# Altium project Sampling_Scope.PrjPcb (part 2 of 4)

## Sheet MCU.SchDoc
size A3; ApprovedBy: Mateusz Kowalik; CheckedBy: Mateusz Kowalik; Author: Mateusz Kowalik; CompanyName: InMotion Labs sp. z o.o.; DrawnBy: Mateusz Kowalik; Engineer: Mateusz Kowalik; Organization: InMotion Labs sp. z o.o.; Address1: Rydlówka 5A; Address2: 30-363 Kraków; Address4: Poland; DocumentNumber: 4; Revision: Rev 0; SheetNumber: 3; SheetTotal: 17
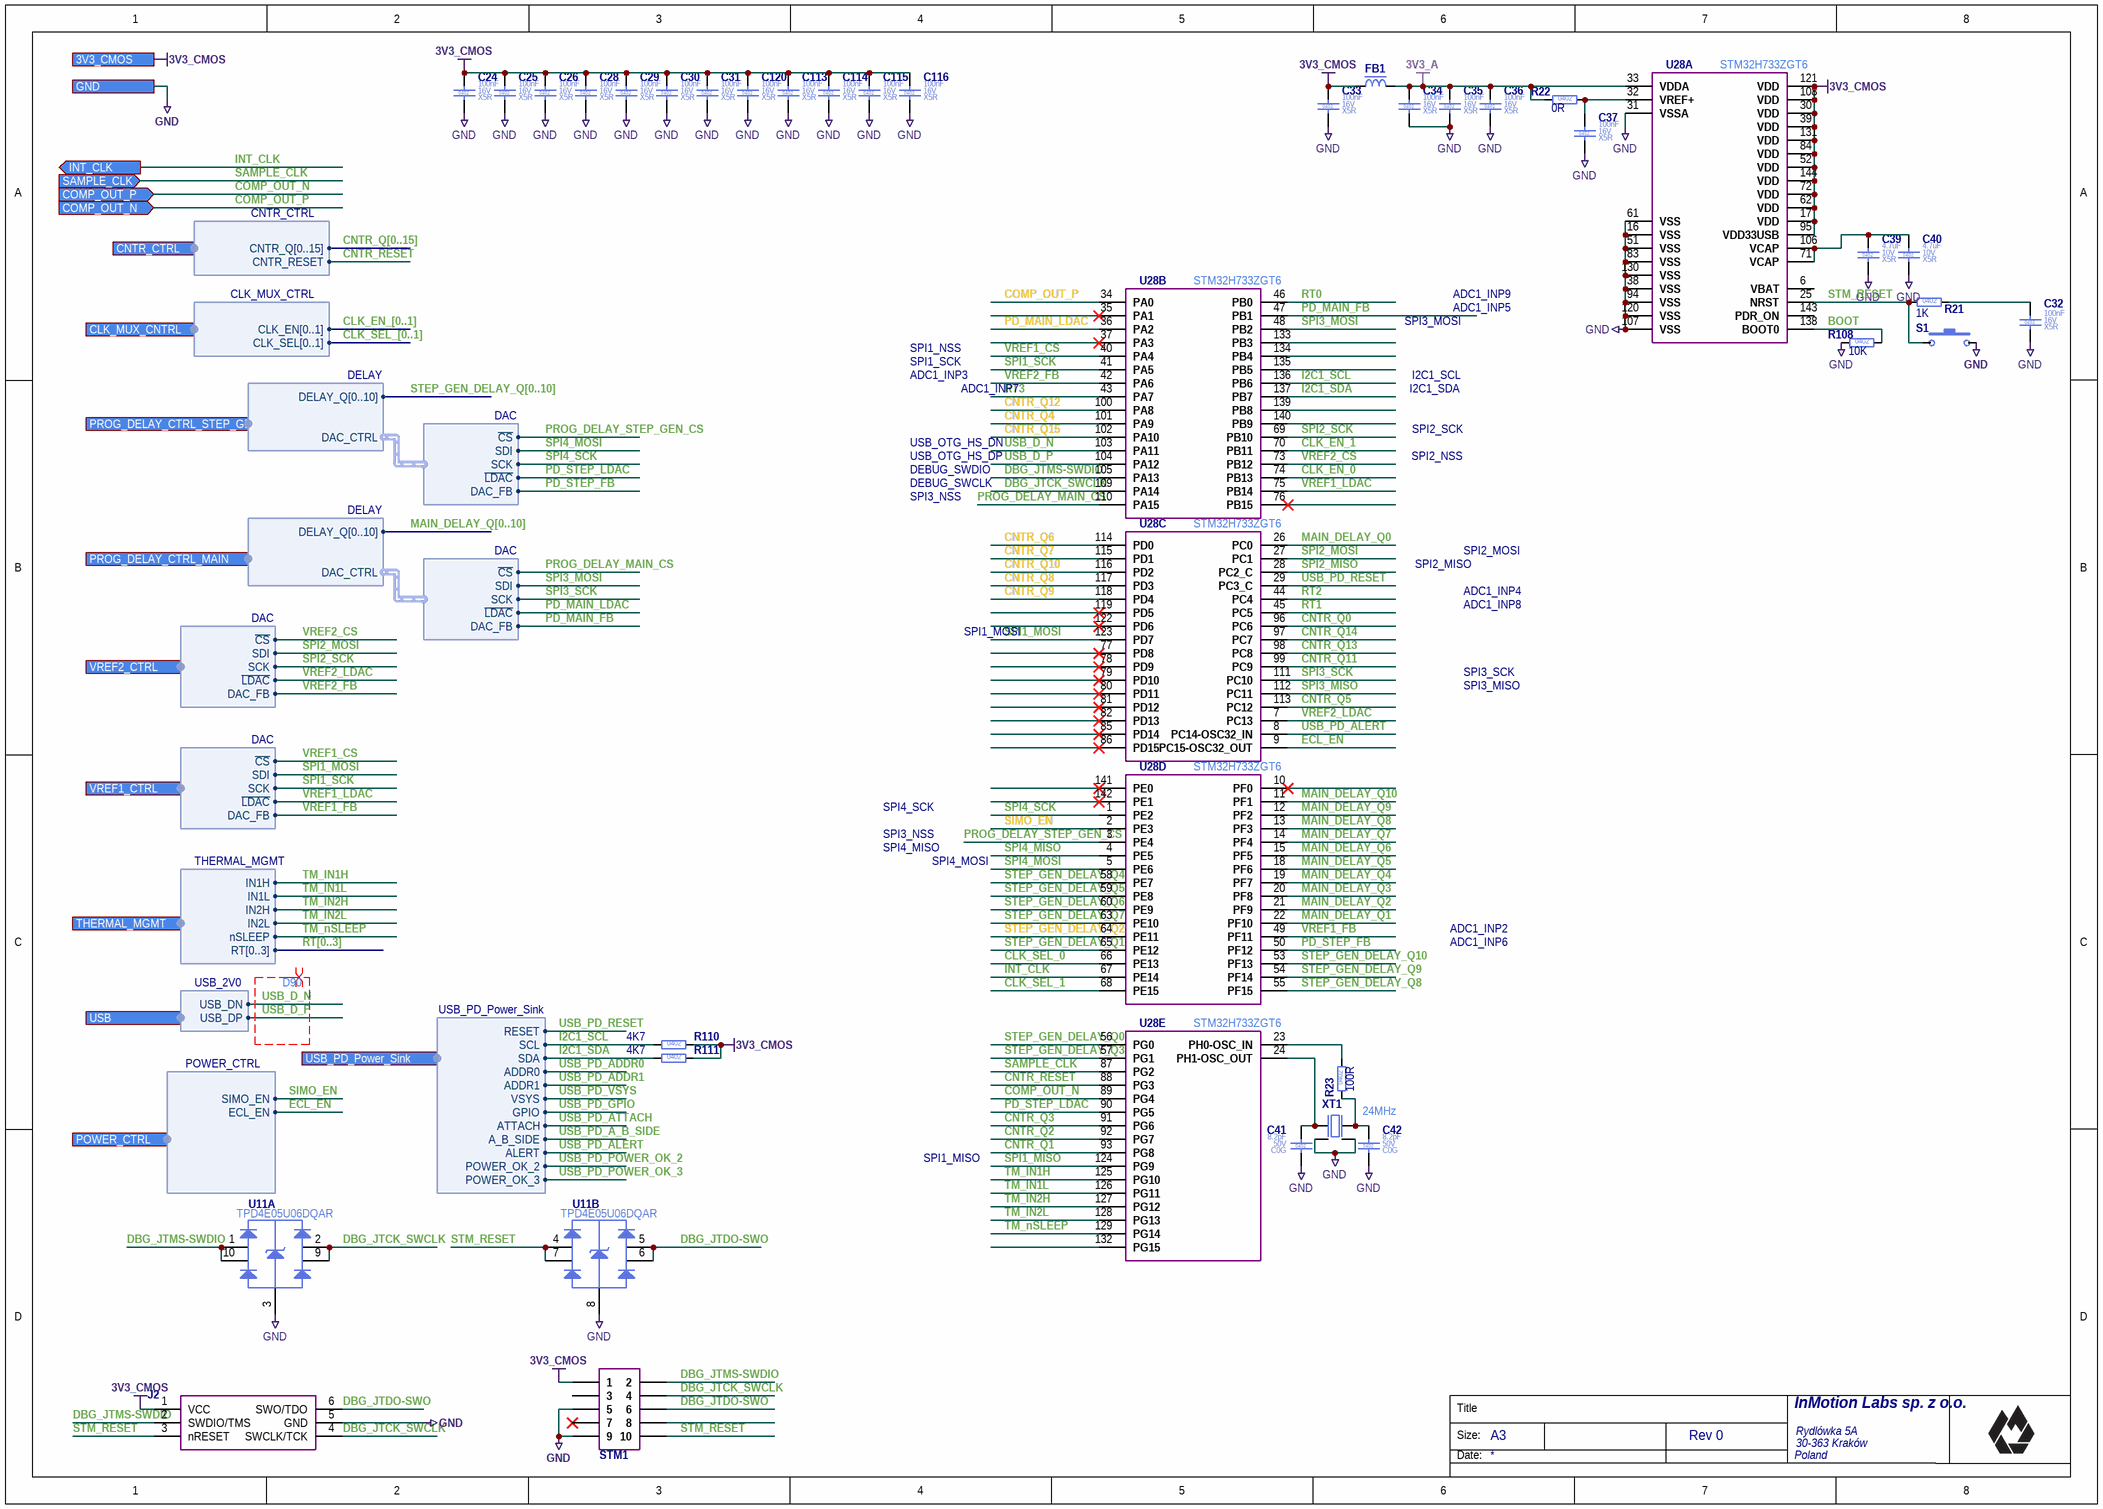
[diagram p5: MCU.SchDoc]

### Parts
C24  Case/Package: 0402  Voltage Rating (DC): 16V  Dielectric: X5R  Capacitance: 100nF  [C_0402_1005]  (hidden comment: C_100NF_16V_X5R_0402_10)
C25  Case/Package: 0402  Voltage Rating (DC): 16V  Dielectric: X5R  Capacitance: 100nF  [C_0402_1005]  (hidden comment: C_100NF_16V_X5R_0402_10)
C26  Case/Package: 0402  Voltage Rating (DC): 16V  Dielectric: X5R  Capacitance: 100nF  [C_0402_1005]  (hidden comment: C_100NF_16V_X5R_0402_10)
C28  Case/Package: 0402  Voltage Rating (DC): 16V  Dielectric: X5R  Capacitance: 100nF  [C_0402_1005]  (hidden comment: C_100NF_16V_X5R_0402_10)
C29  Case/Package: 0402  Voltage Rating (DC): 16V  Dielectric: X5R  Capacitance: 100nF  [C_0402_1005]  (hidden comment: C_100NF_16V_X5R_0402_10)
C30  Case/Package: 0402  Voltage Rating (DC): 16V  Dielectric: X5R  Capacitance: 100nF  [C_0402_1005]  (hidden comment: C_100NF_16V_X5R_0402_10)
C31  Case/Package: 0402  Voltage Rating (DC): 16V  Dielectric: X5R  Capacitance: 100nF  [C_0402_1005]  (hidden comment: C_100NF_16V_X5R_0402_10)
C32  Case/Package: 0402  Voltage Rating (DC): 16V  Dielectric: X5R  Capacitance: 100nF  [C_0402_1005]  (hidden comment: C_100NF_16V_X5R_0402_10)
C33  Case/Package: 0402  Voltage Rating (DC): 16V  Dielectric: X5R  Capacitance: 100nF  [C_0402_1005]  (hidden comment: C_100NF_16V_X5R_0402_10)
C34  Case/Package: 0402  Voltage Rating (DC): 16V  Dielectric: X5R  Capacitance: 100nF  [C_0402_1005]  (hidden comment: C_100NF_16V_X5R_0402_10)
C35  Case/Package: 0402  Voltage Rating (DC): 16V  Dielectric: X5R  Capacitance: 100nF  [C_0402_1005]  (hidden comment: C_100NF_16V_X5R_0402_10)
C36  Case/Package: 0402  Voltage Rating (DC): 16V  Dielectric: X5R  Capacitance: 100nF  [C_0402_1005]  (hidden comment: C_100NF_16V_X5R_0402_10)
C37  Case/Package: 0402  Voltage Rating (DC): 16V  Dielectric: X5R  Capacitance: 100nF  [C_0402_1005]  (hidden comment: C_100NF_16V_X5R_0402_10)
C39  Case/Package: 0402  Voltage Rating (DC): 10V  Dielectric: X5R  Capacitance: 4.7uF  [C_0402_1005]  (hidden comment: C_4U7F_10V_X5R_0402_20)
C40  Case/Package: 0402  Voltage Rating (DC): 10V  Dielectric: X5R  Capacitance: 4.7uF  [C_0402_1005]  (hidden comment: C_4U7F_10V_X5R_0402_20)
C41  Case/Package: 0402  Voltage Rating (DC): 50V  Dielectric: C0G  Capacitance: 8.2pF  [C_0402_1005]  (hidden comment: C_8P2F_50V_C0G_0402_3)
C42  Case/Package: 0402  Voltage Rating (DC): 50V  Dielectric: C0G  Capacitance: 8.2pF  [C_0402_1005]  (hidden comment: C_8P2F_50V_C0G_0402_3)
C113  Case/Package: 0402  Voltage Rating (DC): 16V  Dielectric: X5R  Capacitance: 100nF  [C_0402_1005]  (hidden comment: C_100NF_16V_X5R_0402_10)
C114  Case/Package: 0402  Voltage Rating (DC): 16V  Dielectric: X5R  Capacitance: 100nF  [C_0402_1005]  (hidden comment: C_100NF_16V_X5R_0402_10)
C115  Case/Package: 0402  Voltage Rating (DC): 16V  Dielectric: X5R  Capacitance: 100nF  [C_0402_1005]  (hidden comment: C_100NF_16V_X5R_0402_10)
C116  Case/Package: 0402  Voltage Rating (DC): 16V  Dielectric: X5R  Capacitance: 100nF  [C_0402_1005]  (hidden comment: C_100NF_16V_X5R_0402_10)
C120  Case/Package: 0402  Voltage Rating (DC): 16V  Dielectric: X5R  Capacitance: 100nF  [C_0402_1005]  (hidden comment: C_100NF_16V_X5R_0402_10)
FB1  MLZ2012M2R2HT000  [FB_0805_2012]  (value not drawn)
J2  TC2030-IDC-NL  [TC2030-IDC-NL]  (value not drawn)  (no BOM)
R21  Resistance: 1K  Case/Package: 0402  [R_0402_1005]  (hidden comment: R_1K_0402_1)
R22  Resistance: 0R  Case/Package: 0402  [R_0402_1005]  (hidden comment: R_0R_0402_1)
R23  Resistance: 100R  Case/Package: 0402  [R_0402_1005]  (hidden comment: R_100R_0402_1)
R108  Resistance: 10K  Case/Package: 0402  [R_0402_1005]  (hidden comment: R_10K_0402_1)
R110  Resistance: 4K7  Case/Package: 0402  [R_0402_1005]  (hidden comment: R_4K7_0402_1)
R111  Resistance: 4K7  Case/Package: 0402  [R_0402_1005]  (hidden comment: R_4K7_0402_1)
S1  EVQ-P7J01P  [EVQ-P7J01P]  (value not drawn)
STM1  FTSH-105-01-L-DV-K-TR  [FTSH-105-01-L-DV-K-TR]  (value not drawn)
U11  TPD4E05U06DQAR  [SON50P100X55-10N]  (parts A,B of 2)
U28  STM32H733ZGT6  [TSQFP50P2200X2200X160-144N]  (parts A,B,C,D,E of 5)
XT1  Frequency: 24MHz  [X_3.2x2.5]  (hidden comment: TSX-3225 24.0000MF20G-AC)

### Ports
3V3_CMOS, CLK_MUX_CNTRL (harness CLK_MUX_CTRL), CNTR_CTRL (harness CNTR_CTRL), COMP_OUT_N (in), COMP_OUT_P (in), GND, INT_CLK (out), POWER_CTRL (harness POWER_CTRL), PROG_DELAY_CTRL_MAIN (harness DELAY), PROG_DELAY_CTRL_STEP_GEN (harness DELAY), SAMPLE_CLK (in), THERMAL_MGMT (harness THERMAL_MGMT), USB (harness USB_2V0), USB_PD_Power_Sink (harness USB_PD_Power_Sink), VREF1_CTRL (harness DAC), VREF2_CTRL (harness DAC)

### Harnesses
DELAY: DELAY_Q[0..10], DAC_CTRL
CNTR_CTRL: CNTR_Q[0..15], CNTR_RESET
CLK_MUX_CTRL: CLK_SEL[0..1], CLK_EN[0..1]
DAC: ~{CS}, SDI, SCK, ~{LDAC}, DAC_FB
THERMAL_MGMT: IN1H, IN1L, IN2H, IN2L, nSLEEP, RT[0..3]
USB_2V0: USB_DN, USB_DP
USB_PD_Power_Sink: RESET, SCL, SDA, ADDR0, ADDR1, VSYS, GPIO, ATTACH, A_B_SIDE, ALERT, POWER_OK_2, POWER_OK_3
POWER_CTRL: SIMO_EN, ECL_EN

### Nets
3V3_A: C34.1 C35.1 C36.1 FB1.2 R22.1 U28.33(VDDA)
3V3_CMOS: C24.1 C25.1 C26.1 C28.1 C29.1 C30.1 C31.1 C33.1 C113.1 C114.1 C115.1 C116.1 C120.1 FB1.1 J2.1(VCC) R110.2 R111.2 STM1.1 U28.17(VDD) U28.30(VDD) U28.39(VDD) U28.52(VDD) U28.62(VDD) U28.72(VDD) U28.84(VDD) U28.95(VDD33USB) U28.108(VDD) U28.121(VDD) U28.131(VDD) U28.144(VDD) ; port 3V3_CMOS
GND: C24.2 C25.2 C26.2 C28.2 C29.2 C30.2 C31.2 C32.2 C33.2 C34.2 C35.2 C36.2 C37.2 C39.2 C40.2 C41.2 C42.2 C113.2 C114.2 C115.2 C116.2 C120.2 J2.5(GND) R108.1 S1.2 STM1.5 STM1.9 U11.3(GND) U11.8(GND) U28.16(VSS) U28.31(VSSA) U28.38(VSS) U28.51(VSS) U28.61(VSS) U28.83(VSS) U28.94(VSS) U28.107(VSS) U28.120(VSS) U28.130(VSS) XT1.2(GND) XT1.4(GND) ; port GND
BOOT: R108.2 U28.138(BOOT0)  [project net BOOT_3]
CLK_EN_0: U28.74(PB13)
CLK_EN_1: U28.70(PB11)
CLK_SEL_0: U28.66(PE13)
CLK_SEL_1: U28.68(PE15)
CNTR_Q0: U28.96(PC6)
CNTR_Q1: U28.93(PG8)
CNTR_Q2: U28.92(PG7)
CNTR_Q3: U28.91(PG6)
CNTR_Q4: U28.101(PA9)
CNTR_Q5: U28.113(PC12)
CNTR_Q6: U28.114(PD0)
CNTR_Q7: U28.115(PD1)
CNTR_Q8: U28.117(PD3)
CNTR_Q9: U28.118(PD4)
CNTR_Q10: U28.116(PD2)
CNTR_Q11: U28.99(PC9)
CNTR_Q12: U28.100(PA8)
CNTR_Q13: U28.98(PC8)
CNTR_Q14: U28.97(PC7)
CNTR_Q15: U28.102(PA10)
CNTR_RESET: U28.88(PG3) ; port CNTR_CTRL.CNTR_RESET  [project net CNTR_CTRL.CNTR_RESET]
COMP_OUT_N: U28.89(PG4) ; port COMP_OUT_P
COMP_OUT_P: U28.34(PA0) ; port COMP_OUT_N
DBG_JTCK_SWCLK: J2.4(SWCLK/TCK) STM1.4 U11.2(D1-) U11.9(NC) U28.109(PA14)  [project net DBG_JTCK_SWCLK_3]
DBG_JTDO-SWO: J2.6(SWO/TDO) STM1.6 U11.5(D2-) U11.6(NC)  [project net DBG_JTDO-SWO_3]
DBG_JTMS-SWDIO: J2.2(SWDIO/TMS) STM1.2 U11.1(D1+) U11.10(NC) U28.105(PA13)  [project net DBG_JTMS-SWDIO_3]
ECL_EN: U28.9(PC15-OSC32_OUT) ; port POWER_CTRL.ECL_EN  [project net POWER_CTRL.ECL_EN]
I2C1_SCL: R110.1 U28.136(PB6) ; port USB_PD_Power_Sink.SCL  [project net USB_PD_Power_Sink.SCL]
I2C1_SDA: R111.1 U28.137(PB7) ; port USB_PD_Power_Sink.SDA  [project net USB_PD_Power_Sink.SDA]
INT_CLK: U28.67(PE14) ; port INT_CLK
MAIN_DELAY_Q0: U28.26(PC0)  [project net DELAY_Q0]
MAIN_DELAY_Q1: U28.22(PF10)  [project net DELAY_Q1]
MAIN_DELAY_Q2: U28.21(PF9)  [project net DELAY_Q2]
MAIN_DELAY_Q3: U28.20(PF8)  [project net DELAY_Q3]
MAIN_DELAY_Q4: U28.19(PF7)  [project net DELAY_Q4]
MAIN_DELAY_Q5: U28.18(PF6)  [project net DELAY_Q5]
MAIN_DELAY_Q6: U28.15(PF5)  [project net DELAY_Q6]
MAIN_DELAY_Q7: U28.14(PF4)  [project net DELAY_Q7]
MAIN_DELAY_Q8: U28.13(PF3)  [project net DELAY_Q8]
MAIN_DELAY_Q9: U28.12(PF2)  [project net DELAY_Q9]
MAIN_DELAY_Q10: U28.11(PF1)  [project net DELAY_Q10]
PD_MAIN_FB: U28.47(PB1) ; harness DAC.DAC_FB
PD_MAIN_LDAC: U28.36(PA2) ; harness DAC.~{LDAC}
PD_STEP_FB: U28.50(PF12) ; harness DAC.DAC_FB
PD_STEP_LDAC: U28.90(PG5) ; harness DAC.~{LDAC}
PROG_DELAY_MAIN_CS: U28.110(PA15) ; harness DAC.~{CS}
PROG_DELAY_STEP_GEN_CS: U28.3(PE4) ; harness DAC.~{CS}
RT0: U28.46(PB0)
RT1: U28.45(PC5)
RT2: U28.44(PC4)
RT3: U28.43(PA7)
SAMPLE_CLK: U28.87(PG2) ; port SAMPLE_CLK
SIMO_EN: U28.2(PE3) ; port POWER_CTRL.SIMO_EN  [project net POWER_CTRL.SIMO_EN]
SPI1_MISO: U28.124(PG9)  [project net SPI1_MISO_3]
SPI1_MOSI: U28.123(PD7) ; port VREF1_CTRL.SDI  [project net VREF_P_CTRL.SDI]
SPI1_SCK: U28.41(PA5) ; port VREF1_CTRL.SCK  [project net VREF_P_CTRL.SCK]
SPI2_MISO: U28.28(PC2_C)  [project net SPI2_MISO_3]
SPI2_MOSI: U28.27(PC1) ; port VREF2_CTRL.SDI  [project net VREF_N_CTRL.SDI]
SPI2_SCK: U28.69(PB10) ; port VREF2_CTRL.SCK  [project net VREF_N_CTRL.SCK]
SPI3_MISO: U28.112(PC11)  [project net SPI3_MISO_3]
SPI3_MOSI: U28.48(PB2) ; harness DAC.SDI
SPI3_SCK: U28.111(PC10) ; harness DAC.SCK
SPI4_MISO: U28.4(PE5)  [project net SPI4_MISO_3]
SPI4_MOSI: U28.5(PE6) ; harness DAC.SDI
SPI4_SCK: U28.1(PE2) ; harness DAC.SCK
STEP_GEN_DELAY_Q0: U28.56(PG0)  [project net DELAY_Q0]
STEP_GEN_DELAY_Q1: U28.65(PE12)  [project net DELAY_Q1]
STEP_GEN_DELAY_Q2: U28.64(PE11)  [project net DELAY_Q2]
STEP_GEN_DELAY_Q3: U28.57(PG1)  [project net DELAY_Q3]
STEP_GEN_DELAY_Q4: U28.58(PE7)  [project net DELAY_Q4]
STEP_GEN_DELAY_Q5: U28.59(PE8)  [project net DELAY_Q5]
STEP_GEN_DELAY_Q6: U28.60(PE9)  [project net DELAY_Q6]
STEP_GEN_DELAY_Q7: U28.63(PE10)  [project net DELAY_Q7]
STEP_GEN_DELAY_Q8: U28.55(PF15)  [project net DELAY_Q8]
STEP_GEN_DELAY_Q9: U28.54(PF14)  [project net DELAY_Q9]
STEP_GEN_DELAY_Q10: U28.53(PF13)  [project net DELAY_Q10]
STM_RESET: J2.3(nRESET) R21.1 S1.1 STM1.10 U11.4(D2+) U11.7(NC) U28.25(NRST)  [project net STM_RESET_3]
TM_IN1H: U28.125(PG10) ; port THERMAL_MGMT.IN1H  [project net THERMAL_MGMT.IN1H]
TM_IN1L: U28.126(PG11) ; port THERMAL_MGMT.IN1L  [project net THERMAL_MGMT.IN1L]
TM_IN2H: U28.127(PG12) ; port THERMAL_MGMT.IN2H  [project net THERMAL_MGMT.IN2H]
TM_IN2L: U28.128(PG13) ; port THERMAL_MGMT.IN2L  [project net THERMAL_MGMT.IN2L]
TM_nSLEEP: U28.129(PG14) ; port THERMAL_MGMT.nSLEEP  [project net THERMAL_MGMT.nSLEEP]
USB_D_N: U28.103(PA11) ; port USB.USB_DN
USB_D_P: U28.104(PA12) ; port USB.USB_DP
USB_PD_ALERT: U28.8(PC14-OSC32_IN) ; port USB_PD_Power_Sink.ALERT  [project net USB_PD_Power_Sink.ALERT]
USB_PD_RESET: U28.29(PC3_C) ; port USB_PD_Power_Sink.RESET  [project net USB_PD_Power_Sink.RESET]
VREF1_CS: U28.40(PA4) ; port VREF1_CTRL.~{CS}  [project net VREF_P_CTRL~{.}CS]
VREF1_FB: U28.49(PF11) ; port VREF1_CTRL.DAC_FB  [project net VREF_P_CTRL.DAC_FB]
VREF1_LDAC: U28.75(PB14) ; port VREF1_CTRL.~{LDAC}  [project net VREF_P_CTRL~{.}LDAC]
VREF2_CS: U28.73(PB12) ; port VREF2_CTRL.~{CS}  [project net VREF_N_CTRL~{.}CS]
VREF2_FB: U28.42(PA6) ; port VREF2_CTRL.DAC_FB  [project net VREF_N_CTRL.DAC_FB]
VREF2_LDAC: U28.7(PC13) ; port VREF2_CTRL.~{LDAC}  [project net VREF_N_CTRL~{.}LDAC]
NetC32_1: C32.1 R21.2
NetC37_1: C37.1 R22.2 U28.32(VREF+)
NetC39_1: C39.1 C40.1 U28.71(VCAP) U28.106(VCAP)
NetC41_1: C41.1 U28.24(PH1-OSC_OUT) XT1.1(IN)
NetC42_1: C42.1 R23.1 XT1.3(OUT)
NetR23_2: R23.2 U28.23(PH0-OSC_IN)

Not connected (* = marked no-connect by the designer): STM1 3 7* 8; U28 6(VBAT) 10(PF0)* 35(PA1)* 37(PA3)* 76(PB15)* 77(PD8)* 78(PD9)* 79(PD10)* 80(PD11)* 81(PD12)* 82(PD13)* 85(PD14)* 86(PD15)* 119(PD5)* 122(PD6)* 132(PG15) 133(PB3) 134(PB4) 135(PB5) 139(PB8) 140(PB9) 141(PE0)* 142(PE1)* 143(PDR_ON)

### Buses and harness runs
bus CLK_EN_[0..1]
bus CLK_SEL_[0..1]
bus CNTR_Q[0..15]
bus MAIN_DELAY_Q[0..10]
bus RT[0..3]
bus STEP_GEN_DELAY_Q[0..10]

### Layout directives
differential pair; differential pair class D90: USB_D_N, USB_D_P

### Notes on the sheet
- ADC1_INP5
- ADC1_INP9
- ADC1_INP3
- SPI1_SCK
- SPI1_NSS
- SPI3_MOSI
- I2C1_SCL
- USB_OTG_HS_DN
- ADC1_INP7
- I2C1_SDA
- SPI2_SCK
- USB_OTG_HS_DP
- DEBUG_SWCLK
- DEBUG_SWDIO
- SPI3_NSS
- SPI2_NSS
- SPI2_MISO
- SPI2_MOSI
- SPI1_MOSI
- ADC1_INP4
- ADC1_INP8
- SPI3_SCK
- SPI3_MISO
- SPI4_MISO
- SPI4_SCK
- SPI4_MOSI
- ADC1_INP6
- ADC1_INP2
- SPI1_MISO
- Title
- Size:
- Date:
- A3

### Library data of the parts
C24-C26 C28-C31 C33-C37 C113-C116 C120 = C_100NF_16V_X5R_0402_10: as C1 on sheet Main; Part Number: C_100NF_16V_X5R_0402_10; Mount: Surface Mount; Height: 500um; HelpURL: http://datasheet.octopart.com/EMK105BJ104KV-F-Taiyo-Yuden-datasheet-8857305.pdf; RoHS: Compliant; Max Operating Temperature: 125°C; Status: MK; Supplier 1: Mouser; Supplier Part Number 1: 963-EMK105BJ104KV-F; Manufacturer 2: Samsung Electro-Mechanics; Manufacturer Part Number 2: CL05B104KO5NNNC; Supplier 2: LCSC; Supplier Part Number 2: C1525
C32 = C_100NF_16V_X5R_0402_10: Ceramic Capacitor; Manufacturer Part Number: EMK105BJ104KV-F; Manufacturer: Taiyo Yuden; Tolerance: 10%; Value: 100nF; Part Number: C_100NF_16V_X5R_0402_10; Mount: Surface Mount; Height: 500um; HelpURL: http://datasheet.octopart.com/EMK105BJ104KV-F-Taiyo-Yuden-datasheet-8857305.pdf; RoHS: Compliant; Max Operating Temperature: 125°C; Status: MK; Supplier 1: Mouser; Supplier Part Number 1: 963-EMK105BJ104KV-F; Manufacturer 2: Samsung Electro-Mechanics; Manufacturer Part Number 2: CL05B104KO5NNNC; Supplier 2: LCSC; Supplier Part Number 2: C1525
C39 C40 = C_4U7F_10V_X5R_0402_20: Ceramic Capacitor; Manufacturer Part Number: CL05A475MP5NRNC; Manufacturer: Samsung Electro-Mechanics; Value: 4.7uF; Tolerance: 20%; Part Number: C_4U7F_10V_X5R_0402_20; Mount: Surface Mount; Height: 550um; HelpURL: https://pl.mouser.com/datasheet/2/585/MLCC-1837944.pdf; RoHS: Compliant; Max Operating Temperature: 85°C; Status: MK; Supplier 1: Mouser; Supplier Part Number 1: 187-CL05A475MP5NRNC; Manufacturer 2: Samsung Electro-Mechanics; Manufacturer Part Number 2: CL05A475MP5NRNC; Supplier 2: LCSC; Supplier Part Number 2: C23733
C41 C42 = C_8P2F_50V_C0G_0402_3: Ceramic Capacitor; Manufacturer Part Number: UMK105CG8R2DV-F; Manufacturer: Taiyo Yuden; Value: 8.2pF; Tolerance: 3%; Part Number: C_8P2F_50V_C0G_0402_3; Mount: Surface Mount; Height: 500um; HelpURL: https://pl.mouser.com/datasheet/2/396/mlcc02_e-1307760.pdf; RoHS: Compliant; Max Operating Temperature: 125°C; Status: MK; Supplier 1: Mouser; Supplier Part Number 1: 963-UMK105CG8R2DV-F
FB1 = MLZ2012M2R2HT000: Ferrite Bead; Manufacturer: TDK; Max Current Rating: 600mA; Frequency: 2MHz; Impedance: 30; Tolerance: 20; DC Resistance (DCR): 208m; Box: 412; Part Number: MLZ2012M2R2HT000; Case/Package: 0805; Manufacturer Part Number: MLZ2012M2R2HT000; Height: 1.45mm; Mount: Surface Mount; Max Operating Temperature: 125°C; HelpURL: https://product.tdk.com/info/en/catalog/datasheets/inductor_commercial_decoupling_mlz2012_en.pdf?ref_disty=mouser; RoHS: Compliant; Status: MK; Supplier 1: Mouser; Supplier Part Number 1: 810-MLZ2012M2R2HT000; Stock: 15
J2 = TC2030-IDC-NL: Pads to program board through TC2030; Manufacturer: Tag-Connect; Part Number: TC2030-IDC-NL; Manufacturer Part Number: TC2030-IDC-NL; Number of Rows: 2
R21 = R_1K_0402_1: Thick Film Resistor; Manufacturer: Yageo; Manufacturer Part Number: RC0402FR-7D1KL; Tolerance: 1%; Voltage Rating (DC): 50V; Power Rating: 63mW; Stats: MK; Value: 1K; Part Number: R_1K_0402_1; Mount: Surface Mount; Height: 350um; HelpURL: https://pl.mouser.com/datasheet/2/447/PYu-RC_Group_51_RoHS_L_10-1664068.pdf; RoHS: Compliant; Max Operating Temperature: 155°C; Supplier 1: Mouser; Supplier Part Number 1: 603-RC0402FR-7D1KL; Manufacturer 2: Uniroyal Elec; Manufacturer Part Number 2: 0402WGF1001TCE; Supplier 2: LCSC; Supplier Part Number 2: C11702
R22 = R_0R_0402_1: as R11 on sheet Comparator-Sampler; Part Number: R_0R_0402_1; Mount: Surface Mount; Height: 350um; HelpURL: http://datasheet.octopart.com/2176049-1-TE-Connectivity---AMP-datasheet-11120217.pdf; RoHS: Compliant; Max Operating Temperature: 155°C; Supplier 1: Mouser; Supplier Part Number 1: 603-RC0402FR-070RL; Manufacturer 2: Uniroyal Elec; Manufacturer Part Number 2: 0402WGF0000TCE; Supplier 2: LCSC; Supplier Part Number 2: C17168
R23 = R_100R_0402_1: Thick Film Resistor; Manufacturer: Yageo; Manufacturer Part Number: RC0402FR-13100RL; Value: 100R; Tolerance: 1%; Voltage Rating (DC): 50V; Power Rating: 63mW; Part Number: R_100R_0402_1; Mount: Surface Mount; Height: 350um; HelpURL: https://pl.mouser.com/datasheet/2/447/PYu-RC_Group_51_RoHS_L_10-1527934.pdf; Max Operating Temperature: 155°C; Supplier 1: Mouser; Supplier Part Number 1: 603-RC0402FR-13100RL; RoHS: Compliant; Manufacturer 2: Uniroyal Elec; Manufacturer Part Number 2: 0402WGF1000TCE; Supplier 2: LCSC; Supplier Part Number 2: C25076
R108 = R_10K_0402_1: as R17 on sheet Comparator-Sampler; Part Number: R_10K_0402_1; Mount: Surface Mount; Height: 350um; HelpURL: https://pl.mouser.com/datasheet/2/447/PYu-RC_Group_51_RoHS_L_10-1664068.pdf; RoHS: Compliant; Max Operating Temperature: 155°C; Supplier 1: Mouser; Supplier Part Number 1: 603-RC0402FR-7W10KL; Manufacturer 2: Uniroyal Elec; Manufacturer Part Number 2: 0402WGF1002TCE; Supplier 2: LCSC; Supplier Part Number 2: C25744
R110 R111 = R_4K7_0402_1: Thick Film Resistor; Manufacturer: Yageo; Manufacturer Part Number: RC0402FR-7D4K7L; Value: 4K7; Tolerance: 1%; Voltage Rating (DC): 50V; Power Rating: 63mW; Part Number: R_4K7_0402_1; Mount: Surface Mount; Height: 350um; HelpURL: https://pl.mouser.com/datasheet/2/447/PYu-RC_Group_51_RoHS_L_10-1527934.pdf; RoHS: Compliant; Max Operating Temperature: 155°C; Supplier 1: Mouser; Supplier Part Number 1: 603-RC0402FR-7D4K7L
S1 = EVQ-P7J01P: Tact Switch; Manufacturer: Panasonic; Switch Function: Off-Mom; Throw Configuration: SPST-NO; Box: 87; Part Number: EVQ-P7J01P; Manufacturer Part Number: EVQ-P7J01P; Orientation: Vertical; Mount: Surface Mount; RoHS: Compliant; HelpURL: http://datasheet.octopart.com/EVQ-P7J01P-Panasonic-datasheet-13271580.pdf; Supplier 1: DigiKey; Supplier Part Number 1: P16767CT-ND; Stock: 46
STM1 = FTSH-105-01-L-DV-K-TR: CONN HEADER SMD 10POS 1.27MM; Manufacturer: Samtec; Gender: Male; Box: A1; Part Number: FTSH-105-01-L-DV-K-TR; Manufacturer Part Number: FTSH-105-01-L-DV-K-TR; Pitch: 1.27mm; Mount: Surface Mount; Number of Rows: 2; Orientation: Straight; Series: FTSH; HelpURL: https://datasheet.octopart.com/FTSH-105-01-L-DV-K-Samtec-datasheet-97029545.pdf; Max Operating Temperature: 125°C; RoHS: Compliant; Supplier 1: Mouser; Supplier Part Number 1: 200-FTSH10501LDVKTR; Stock: 18
U11 = TPD4E05U06DQAR: ESD Suppressors / TVS Diodes 4Chnl U-Lo Capacitnc IEC ESD Prot Diodes; Manufacturer: Texas Instruments; Capacitance: 0.5 pF; Max Power Dissipation: 40W; Direction: Unidirectional; Max Breakdown Voltage: 8.5V; Working Voltage: 5.5V; Min Breakdown Voltage: 6.5V; Box: 367; Manufacturer Part Number: TPD4E05U06DQAR; Part Number: TPD4E05U06DQAR; Case/Package: USON-10; Mount: Surface Mount; HelpURL: http://www.ti.com/lit/ds/symlink/tpd4e05u06.pdf; Max Operating Temperature: 125°C; RoHS: Compliant; Height: 0.55; Status: AK; Supplier 1: Mouser; Supplier Part Number 1: 595-TPD4E05U06DQAR; Stock: 6
U28 = STM32H733ZGT6: MCU, 32 Bit, Cortex M7 RISC 1MB Flash 144 LQFP; Manufacturer: STMicroelectronics; Core Architecture: ARM; Max Frequency: 550MHz; Min Supply Voltage: 1.7V; Max Supply Voltage: 3.6V; RAM Size: 432KB; Manufacturer Part Number: STM32H733ZGT6; Part Number: STM32H733ZGT6; Mount: Surface Mount; Case/Package: TQFP; Height: 1.6mm; HelpURL: https://pl.mouser.com/datasheet/2/389/dm00701031-2042107.pdf; Memory Size: 1MB; Memory Type: FLASH; Max Operating Temperature: 85°C; Number of Pins: 144; RoHS: Compliant; Status: MK; Supplier 1: Mouser; Supplier Part Number 1: 511-STM32H733ZGT6
XT1 = TSX-3225 24.0000MF20G-AC: Resonator Ceramic; Manufacturer: Epson; Manufacturer Part Number: TSX-3225 24.0000MF20G-AC0; Frequency Tolerance: 10ppm; Box: 236; Part Number: TSX-3225 24.0000MF20G-AC; Mount: Surface Mount; Height: 0.6mm; HelpURL: https://pl.mouser.com/datasheet/2/137/FA_238_en-932914.pdf; Max Operating Temperature: 75C; Number of Pins: 4; RoHS: Compliant; Supplier 1: Mouser; Supplier Part Number 1: 732-322524F20GAC0; Stock: 21

## Sheet POWER.SchDoc
size A4; ApprovedBy: Mateusz Kowalik; CheckedBy: Mateusz Kowalik; Author: Mateusz Kowalik; CompanyName: InMotion Labs sp. z o.o.; DrawnBy: Mateusz Kowalik; Engineer: Mateusz Kowalik; Organization: InMotion Labs sp. z o.o.; Address1: Rydlówka 5A; Address2: 30-363 Kraków; Address4: Poland; DocumentNumber: 5; Revision: Rev 0; SheetNumber: 4; SheetTotal: 17
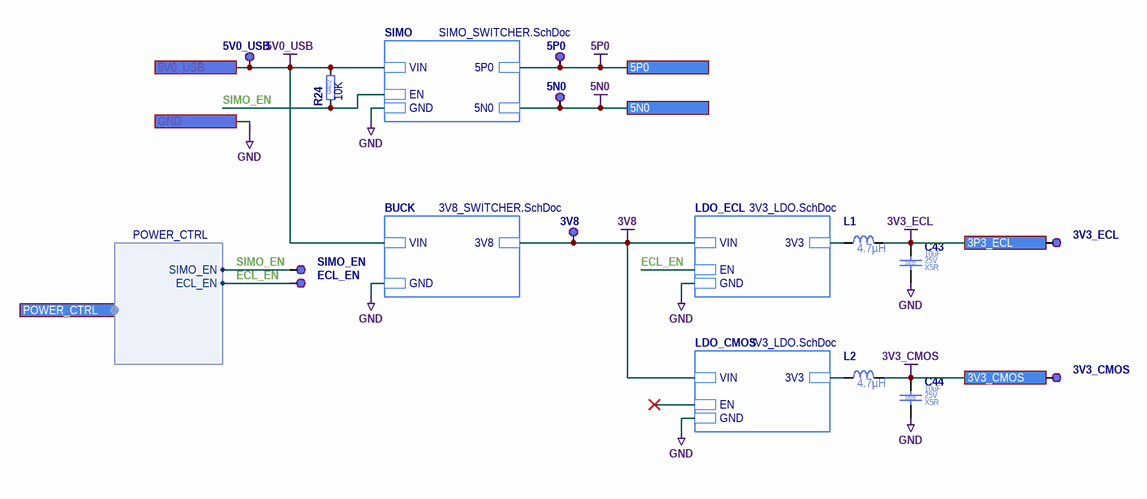
[diagram p6: POWER.SchDoc]

### Parts
3V3_CMOS  TP_PAD_1.3MM  [TP_PAD_1.3MM]  (value not drawn)  (no BOM)
3V3_ECL  TP_PAD_1.3MM  [TP_PAD_1.3MM]  (value not drawn)  (no BOM)
3V8  TP_PAD_1.3MM  [TP_PAD_1.3MM]  (value not drawn)  (no BOM)
5N0  TP_PAD_1.3MM  [TP_PAD_1.3MM]  (value not drawn)  (no BOM)
5P0  TP_PAD_1.3MM  [TP_PAD_1.3MM]  (value not drawn)  (no BOM)
5V0_USB  TP_PAD_1.3MM  [TP_PAD_1.3MM]  (value not drawn)  (no BOM)
C43  Case/Package: 0805  Voltage Rating (DC): 25V  Dielectric: X5R  Capacitance: 10uF  [C_0805_2012]  (hidden comment: C_10UF_25V_X5R_0805_10)
C44  Case/Package: 0805  Voltage Rating (DC): 25V  Dielectric: X5R  Capacitance: 10uF  [C_0805_2012]  (hidden comment: C_10UF_25V_X5R_0805_10)
ECL_EN  TP_PAD_1.3MM  [TP_PAD_1.3MM]  (value not drawn)  (no BOM)
L1  Inductance: 4.7µH  [L_1008_2520]  (hidden comment: 1239AS-H-4R7M=P2)
L2  Inductance: 4.7µH  [L_1008_2520]  (hidden comment: 1239AS-H-4R7M=P2)
R24  Resistance: 10K  Case/Package: 0402  [R_0402_1005]  (hidden comment: R_10K_0402_1)
SIMO_EN  TP_PAD_1.3MM  [TP_PAD_1.3MM]  (value not drawn)  (no BOM)

### Sub-sheets
BUCK = 3V8_SWITCHER.SchDoc: 3V8, GND, VIN
LDO_CMOS = 3V3_LDO.SchDoc: 3V3, GND, VIN, EN
LDO_ECL = 3V3_LDO.SchDoc: 3V3, GND, VIN, EN
SIMO = SIMO_SWITCHER.SchDoc: 5P0, GND, VIN, 5N0, EN

### Ports
3P3_ECL, 3V3_CMOS, 5N0, 5P0, 5V0_USB, GND, POWER_CTRL (harness POWER_CTRL)

### Harnesses
POWER_CTRL: SIMO_EN, ECL_EN

### Nets
3V3: L1.1 ; sheet LDO_ECL/3V3
3V3: L2.1 ; sheet LDO_CMOS/3V3  [a separate net that carries the same name]
3V3_CMOS: 3V3_CMOS.1(TP) C44.1 L2.2 ; port 3V3_CMOS
3V3_ECL: 3V3_ECL.1(TP) C43.1 L1.2 ; port 3P3_ECL
3V8: 3V8.1(TP) ; sheet LDO_ECL/VIN, sheet LDO_CMOS/VIN, sheet BUCK/3V8
5N0: 5N0.1(TP) ; port 5N0, sheet SIMO/5N0
5P0: 5P0.1(TP) ; port 5P0, sheet SIMO/5P0
5V0_USB: 5V0_USB.1(TP) R24.2 ; port 5V0_USB, sheet BUCK/VIN, sheet SIMO/VIN
GND: C43.2 C44.2 ; port GND, sheet LDO_ECL/GND, sheet LDO_CMOS/GND, sheet BUCK/GND, sheet SIMO/GND
ECL_EN: ECL_EN.1(TP) ; sheet LDO_ECL/EN, port POWER_CTRL.ECL_EN  [project net POWER_CTRL.ECL_EN]
SIMO_EN: R24.1 SIMO_EN.1(TP) ; sheet SIMO/EN, port POWER_CTRL.SIMO_EN  [project net POWER_CTRL.SIMO_EN]

### Notes on the sheet
- Title
- Size:
- Date:
- A4

### Library data of the parts
3V3_CMOS 3V3_ECL 3V8 5N0 5P0 5V0_USB ECL_EN SIMO_EN = TP_PAD_1.3MM: Testpoint SMD 1.3mm; Part Number: TP_PAD_1.3MM; Case/Package: SMD; Length: 0mm
C43 C44 = C_10UF_25V_X5R_0805_10: Ceramic Capacitor; Manufacturer Part Number: CL21A106KAYNNNE; Manufacturer: Samsung Electro-Mechanics; Value: 10uF; Tolerance: 10%; Part Number: C_10UF_25V_X5R_0805_10; Mount: Surface Mount; Height: 1.35mm; HelpURL: https://pl.mouser.com/datasheet/2/585/MLCC-1837944.pdf; RoHS: Compliant; Max Operating Temperature: 85°C; Status: MK; Supplier 1: Mouser; Supplier Part Number 1: 187-CL21A106KAYNNNE; Supplier 2: LCSC; Supplier Part Number 2: C15850; Manufacturer 2: Samsung Electro-Mechanics; Manufacturer Part Number 2: CL21A106KAYNNNE
L1 L2 = 1239AS-H-4R7M=P2: Power Inductor; Manufacturer: Murata Electronics; Value: 4.7µH; DC Current: 1.5A; Tolerance: 20%; DC Resistance: 240m; Part Number: 1239AS-H-4R7M=P2; Manufacturer Part Number: 1239AS-H-4R7M=P2; Case/Package: DFE252012C; Mount: Surface Mount; Height: 1.2mm; HelpURL: https://pl.mouser.com/datasheet/2/281/product-1023181.pdf; Max Operating Temperature: 85°C; Status: MK; RoHS: Compliant; Supplier 1: Mouser; Supplier Part Number 1: 81-1239AS-H-4R7MP2
R24 = R_10K_0402_1: as R17 on sheet Comparator-Sampler; Part Number: R_10K_0402_1; Mount: Surface Mount; Height: 350um; HelpURL: https://pl.mouser.com/datasheet/2/447/PYu-RC_Group_51_RoHS_L_10-1664068.pdf; RoHS: Compliant; Max Operating Temperature: 155°C; Supplier 1: Mouser; Supplier Part Number 1: 603-RC0402FR-7W10KL; Manufacturer 2: Uniroyal Elec; Manufacturer Part Number 2: 0402WGF1002TCE; Supplier 2: LCSC; Supplier Part Number 2: C25744

## Sheet 3V3_LDO.SchDoc
size A4; ApprovedBy: Mateusz Kowalik; CheckedBy: Mateusz Kowalik; Author: Mateusz Kowalik; CompanyName: InMotion Labs sp. z o.o.; DrawnBy: Mateusz Kowalik; Engineer: Mateusz Kowalik; Organization: InMotion Labs sp. z o.o.; Address1: Rydlówka 5A; Address2: 30-363 Kraków; Address4: Poland; DocumentNumber: 6; Revision: Rev 0; SheetNumber: 5; SheetTotal: 17
Used 2 times, as channels Power/LDO_ECL, Power/LDO_CMOS. Parts and nets are listed once, with the designators drawn on the sheet.
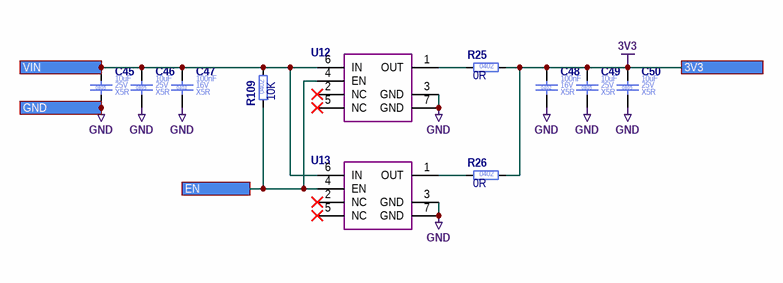
[diagram p7: 3V3_LDO.SchDoc]

### Parts
C45  Case/Package: 0805  Voltage Rating (DC): 25V  Dielectric: X5R  Capacitance: 10uF  [C_0805_2012]  (hidden comment: C_10UF_25V_X5R_0805_10)
C46  Case/Package: 0805  Voltage Rating (DC): 25V  Dielectric: X5R  Capacitance: 10uF  [C_0805_2012]  (hidden comment: C_10UF_25V_X5R_0805_10)
C47  Case/Package: 0402  Voltage Rating (DC): 16V  Dielectric: X5R  Capacitance: 100nF  [C_0402_1005]  (hidden comment: C_100NF_16V_X5R_0402_10)
C48  Case/Package: 0402  Voltage Rating (DC): 16V  Dielectric: X5R  Capacitance: 100nF  [C_0402_1005]  (hidden comment: C_100NF_16V_X5R_0402_10)
C49  Case/Package: 0805  Voltage Rating (DC): 25V  Dielectric: X5R  Capacitance: 10uF  [C_0805_2012]  (hidden comment: C_10UF_25V_X5R_0805_10)
C50  Case/Package: 0805  Voltage Rating (DC): 25V  Dielectric: X5R  Capacitance: 10uF  [C_0805_2012]  (hidden comment: C_10UF_25V_X5R_0805_10)
R25  Resistance: 0R  Case/Package: 0402  [R_0402_1005]  (hidden comment: R_0R_0402_1)
R26  Resistance: 0R  Case/Package: 0402  [R_0402_1005]  (hidden comment: R_0R_0402_1)
R109  Resistance: 10K  Case/Package: 0402  [R_0402_1005]  (hidden comment: R_10K_0402_1)
U12  NCV8705MT33TCG  [WDFN6]  (value not drawn)
U13  NCV8705MT33TCG  [WDFN6]  (value not drawn)

### Ports
3V3, EN, GND, VIN

### Nets
3V3: C48.1 C49.1 C50.1 R25.2 R26.2 ; port 3V3
GND: C45.2 C46.2 C47.2 C48.2 C49.2 C50.2 U12.3(GND) U12.7(GND) U13.3(GND) U13.7(GND) ; port GND
EN: R109.1 U12.4(EN) U13.4(EN) ; port EN
VIN: C45.1 C46.1 C47.1 R109.2 U12.6(IN) U13.6(IN) ; port VIN
NetR25_1: R25.1 U12.1(OUT)
NetR26_1: R26.1 U13.1(OUT)

Not connected (* = marked no-connect by the designer): U12 2(NC)* 5(NC)*; U13 2(NC)* 5(NC)*

### Channels
Power/LDO_ECL: designators end in _LDO_ECL; ports 3V3=3V3 EN=POWER_CTRL.ECL_EN GND=GND VIN=3V8
Power/LDO_CMOS: designators end in _LDO_CMOS; ports 3V3=3V3 EN=NetR109_LDO_CMOS_1 GND=GND VIN=3V8

### Notes on the sheet
- Title
- Size:
- Date:
- A4

### Library data of the parts
C45 C46 C49 C50 = C_10UF_25V_X5R_0805_10: Ceramic Capacitor; Manufacturer Part Number: CL21A106KAYNNNE; Manufacturer: Samsung Electro-Mechanics; Value: 10uF; Tolerance: 10%; Part Number: C_10UF_25V_X5R_0805_10; Mount: Surface Mount; Height: 1.35mm; HelpURL: https://pl.mouser.com/datasheet/2/585/MLCC-1837944.pdf; RoHS: Compliant; Max Operating Temperature: 85°C; Status: MK; Supplier 1: Mouser; Supplier Part Number 1: 187-CL21A106KAYNNNE; Supplier 2: LCSC; Supplier Part Number 2: C15850; Manufacturer 2: Samsung Electro-Mechanics; Manufacturer Part Number 2: CL21A106KAYNNNE
C47 C48 = C_100NF_16V_X5R_0402_10: Ceramic Capacitor; Manufacturer Part Number: EMK105BJ104KV-F; Manufacturer: Taiyo Yuden; Value: 100nF; Tolerance: 10%; Part Number: C_100NF_16V_X5R_0402_10; Mount: Surface Mount; Height: 500um; HelpURL: http://datasheet.octopart.com/EMK105BJ104KV-F-Taiyo-Yuden-datasheet-8857305.pdf; RoHS: Compliant; Max Operating Temperature: 125°C; Status: MK; Supplier 1: Mouser; Supplier Part Number 1: 963-EMK105BJ104KV-F; Manufacturer 2: Samsung Electro-Mechanics; Manufacturer Part Number 2: CL05B104KO5NNNC; Supplier 2: LCSC; Supplier Part Number 2: C1525
R25 R26 = R_0R_0402_1: Thick Film Resistor; Manufacturer: Yageo; Manufacturer Part Number: RC0402FR-070RL; Value: 0R; Tolerance: 1%; Voltage Rating (DC): 50V; Power Rating: 63mW; Stats: MK; Part Number: R_0R_0402_1; Mount: Surface Mount; Height: 350um; HelpURL: http://datasheet.octopart.com/2176049-1-TE-Connectivity---AMP-datasheet-11120217.pdf; RoHS: Compliant; Max Operating Temperature: 155°C; Supplier 1: Mouser; Supplier Part Number 1: 603-RC0402FR-070RL; Manufacturer 2: Uniroyal Elec; Manufacturer Part Number 2: 0402WGF0000TCE; Supplier 2: LCSC; Supplier Part Number 2: C17168
R109 = R_10K_0402_1: Thick Film Resistor; Manufacturer: Yageo; Manufacturer Part Number: RC0402FR-7W10KL; Value: 10K; Tolerance: 1%; Voltage Rating (DC): 50V; Power Rating: 63mW; Stats: MK; Part Number: R_10K_0402_1; Mount: Surface Mount; Height: 350um; HelpURL: https://pl.mouser.com/datasheet/2/447/PYu-RC_Group_51_RoHS_L_10-1664068.pdf; RoHS: Compliant; Max Operating Temperature: 155°C; Supplier 1: Mouser; Supplier Part Number 1: 603-RC0402FR-7W10KL; Manufacturer 2: Uniroyal Elec; Manufacturer Part Number 2: 0402WGF1002TCE; Supplier 2: LCSC; Supplier Part Number 2: C25744
U12 U13 = NCV8705MT33TCG: Low Dropout, Ultra-Low Iq, High PSRR, Ultra-Low Noise 3.3V; Manufacturer: ON Semiconductor; Max Output Current: 500mA; Polarity: Positive; Output Type: Fixed; Accuracy: 0.02; Dropout Voltage: 230mV; Max Input Voltage: 5.5V; Min Input Voltage: 2.5V; Quiescent Current: 13uA; Reference Voltage: 800mV; Box: 220; Part Number: NCV8705MT33TCG; Manufacturer Part Number: NCV8705MT33TCG; Mount: Surface Mount; Nominal Output Voltage: 3.3V; Case/Package: WDFN6; HelpURL: https://datasheet.octopart.com/NCV8705MT33TCG-ON-Semiconductor-datasheet-37177231.pdf; Max Operating Temperature: 150°C; Max Output Voltage: 3.3V; Min Output Voltage: 3.3V; Number of Pins: 7; RoHS: Compliant; Status: MK; Stock: 9; Supplier 1: Mouser; Supplier Part Number 1: 863-NCV8705MT33TCG

## Sheet 3V8_SWITCHER.SchDoc
size A4; ApprovedBy: Mateusz Kowalik; CheckedBy: Mateusz Kowalik; Author: Mateusz Kowalik; CompanyName: InMotion Labs sp. z o.o.; DrawnBy: Mateusz Kowalik; Engineer: Mateusz Kowalik; Organization: InMotion Labs sp. z o.o.; Address1: Rydlówka 5A; Address2: 30-363 Kraków; Address4: Poland; DocumentNumber: 7; Revision: Rev 0; SheetNumber: 6; SheetTotal: 17
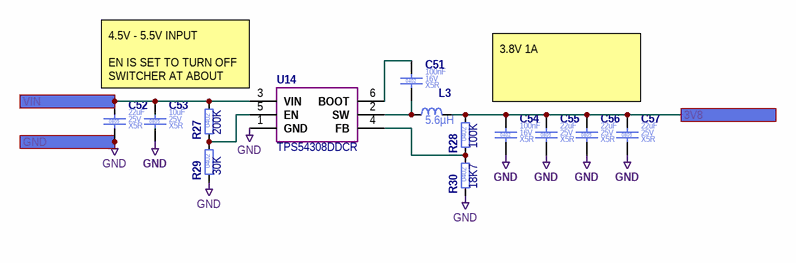
[diagram p8: 3V8_SWITCHER.SchDoc]

### Parts
C51  Case/Package: 0402  Voltage Rating (DC): 16V  Dielectric: X5R  Capacitance: 100nF  [C_0402_1005]  (hidden comment: C_100NF_16V_X5R_0402_10)
C52  Case/Package: 0805  Voltage Rating (DC): 25V  Dielectric: X5R  Capacitance: 22uF  [C_0805_2012]  (hidden comment: C_22UF_25V_X5R_0805_20)
C53  Case/Package: 0805  Voltage Rating (DC): 25V  Dielectric: X5R  Capacitance: 10uF  [C_0805_2012]  (hidden comment: C_10UF_25V_X5R_0805_10)
C54  Case/Package: 0402  Voltage Rating (DC): 16V  Dielectric: X5R  Capacitance: 100nF  [C_0402_1005]  (hidden comment: C_100NF_16V_X5R_0402_10)
C55  Case/Package: 0805  Voltage Rating (DC): 25V  Dielectric: X5R  Capacitance: 22uF  [C_0805_2012]  (hidden comment: C_22UF_25V_X5R_0805_20)
C56  Case/Package: 0805  Voltage Rating (DC): 25V  Dielectric: X5R  Capacitance: 22uF  [C_0805_2012]  (hidden comment: C_22UF_25V_X5R_0805_20)
C57  Case/Package: 0805  Voltage Rating (DC): 25V  Dielectric: X5R  Capacitance: 22uF  [C_0805_2012]  (hidden comment: C_22UF_25V_X5R_0805_20)
L3  Inductance: 5.6µH  [WE-MAPI_4030]  (hidden comment: 74438357056)
R27  Resistance: 200K  Case/Package: 0402  [R_0402_1005]  (hidden comment: R_200K_0402_1)
R28  Resistance: 100K  Case/Package: 0402  [R_0402_1005]  (hidden comment: R_100K_0402_1)
R29  Resistance: 30K  Case/Package: 0402  [R_0402_1005]  (hidden comment: R_30K_0402_1)
R30  Resistance: 18K7  Case/Package: 0402  [R_0402_1005]  (hidden comment: R_18K7_0402_1)
U14  TPS54308DDCR  [SOT23-6_SC74A_SOT753]

### Ports
3V8, GND, VIN

### Nets
3V8: C54.1 C55.1 C56.1 C57.1 L3.2 R28.2 ; port 3V8
5V0_USB: C52.1 C53.1 R27.2 U14.3(VIN) ; port VIN
GND: C52.2 C53.2 C54.2 C55.2 C56.2 C57.2 R29.1 R30.1 U14.1(GND) ; port GND
NetC51_1: C51.1 U14.6(BOOT)
NetC51_2: C51.2 L3.1 U14.2(SW)
NetR27_1: R27.1 R29.2 U14.5(EN)
NetR28_1: R28.1 R30.2 U14.4(FB)

### Notes on the sheet
- 4.5V - 5.5V INPUT
  EN IS SET TO TURN OFF SWITCHER AT ABOUT 4.5V
- 3.8V 1A
- Title
- Size:
- Date:
- A4

### Library data of the parts
C51 C54 = C_100NF_16V_X5R_0402_10: as C47 on sheet 3V3_LDO; Part Number: C_100NF_16V_X5R_0402_10; Mount: Surface Mount; Height: 500um; HelpURL: http://datasheet.octopart.com/EMK105BJ104KV-F-Taiyo-Yuden-datasheet-8857305.pdf; RoHS: Compliant; Max Operating Temperature: 125°C; Status: MK; Supplier 1: Mouser; Supplier Part Number 1: 963-EMK105BJ104KV-F; Manufacturer 2: Samsung Electro-Mechanics; Manufacturer Part Number 2: CL05B104KO5NNNC; Supplier 2: LCSC; Supplier Part Number 2: C1525
C52 C55-C57 = C_22UF_25V_X5R_0805_20: Ceramic Capacitor; Manufacturer Part Number: GRM21BR61E226ME44K; Manufacturer: Murata Electronics; Value: 22uF; Tolerance: 20%; Part Number: C_22UF_25V_X5R_0805_20; Mount: Surface Mount; Height: 1.25mm; HelpURL: http://datasheet.octopart.com/GRM21BR61E226ME44K-Murata-datasheet-14397511.pdf; RoHS: Compliant; Max Operating Temperature: 85°C; Status: MK; Supplier 1: Mouser; Supplier Part Number 1: 81-GRM21BR61E226ME4K; Supplier 2: LCSC; Supplier Part Number 2: C45783; Manufacturer 2: Samsung Electro-Mechanics; Manufacturer Part Number 2: CL21A226MAQNNNE
C53 = C_10UF_25V_X5R_0805_10: as C45 on sheet 3V3_LDO; Part Number: C_10UF_25V_X5R_0805_10; Mount: Surface Mount; Height: 1.35mm; HelpURL: https://pl.mouser.com/datasheet/2/585/MLCC-1837944.pdf; RoHS: Compliant; Max Operating Temperature: 85°C; Status: MK; Supplier 1: Mouser; Supplier Part Number 1: 187-CL21A106KAYNNNE; Supplier 2: LCSC; Supplier Part Number 2: C15850; Manufacturer 2: Samsung Electro-Mechanics; Manufacturer Part Number 2: CL21A106KAYNNNE
L3 = 74438357056: Power Inductor; Manufacturer: Wurth Electronics; Value: 5.6µH; DC Current: 3.6A; Tolerance: 20%; DC Resistance: 46.5m; Saturation Current: 6A; Self Resonant Frequency: 21MHz; Part Number: 74438357056; Manufacturer Part Number: 74438357056; Case/Package: MAPI-4030; Mount: Surface Mount; Height: 3.1mm; HelpURL: https://www.we-online.com/catalog/en/datasheet/74438357056.pdf; Max Operating Temperature: 125°C; Status: MK; RoHS: Compliant; Supplier 1: Wurth electronics; Supplier Part Number 1: 74438357056
R27 = R_200K_0402_1: Thick Film Resistor; Manufacturer: Yageo; Manufacturer Part Number: RC0402FR-07200KL; Value: 200K; Tolerance: 1%; Voltage Rating (DC): 50V; Power Rating: 63mW; Stats: MK; Part Number: R_200K_0402_1; Mount: Surface Mount; Height: 350um; HelpURL: http://datasheet.octopart.com/RC0402FR-07200KL-Yageo-datasheet-10408619.pdf; RoHS: Compliant; Max Operating Temperature: 155°C; Supplier 1: Mouser; Supplier Part Number 1: 603-RC0402FR-07200KL; Manufacturer 2: Uniroyal Elec; Manufacturer Part Number 2: 0402WGJ0204TCE; Supplier 2: LCSC; Supplier Part Number 2: C25544
R28 = R_100K_0402_1: Thick Film Resistor; Manufacturer: Yageo; Manufacturer Part Number: RC0402FR-07100KL; Value: 100K; Tolerance: 1%; Voltage Rating (DC): 50V; Power Rating: 63mW; Stats: MK; Part Number: R_100K_0402_1; Mount: Surface Mount; Height: 350um; HelpURL: http://datasheet.octopart.com/RC0402FR-07100KL-Yageo-datasheet-127823281.pdf; RoHS: Compliant; Max Operating Temperature: 155°C; Supplier 1: Mouser; Supplier Part Number 1: 603-RC0402FR-07100KL; Manufacturer 2: Uniroyal Elec; Manufacturer Part Number 2: 0402WGF1003TCE; Supplier 2: LCSC; Supplier Part Number 2: C25741
R29 = R_30K_0402_1: Thick Film Resistor; Manufacturer: Yageo; Manufacturer Part Number: RC0402FR-0730KL; Value: 30K; Tolerance: 1%; Voltage Rating (DC): 50V; Power Rating: 63mW; Part Number: R_30K_0402_1; Mount: Surface Mount; Height: 350um; HelpURL: https://pl.mouser.com/datasheet/2/447/PYu-RC_Group_51_RoHS_L_10-1527934.pdf; Max Operating Temperature: 155°C; Supplier 1: Mouser; Supplier Part Number 1: 603-RC0402FR-0730KL; Manufacturer 2: Uniroyal Elec; Manufacturer Part Number 2: 0402WGF3002TCE; RoHS: Compliant; Supplier 2: LCSC; Supplier Part Number 2: C25776
R30 = R_18K7_0402_1: Thick Film Resistor; Manufacturer: Yageo; Manufacturer Part Number: RC0402FR-0718K7L; Value: 18K7; Tolerance: 1%; Voltage Rating (DC): 50V; Power Rating: 63mW; Stats: MK; Part Number: R_18K7_0402_1; Mount: Surface Mount; Height: 350um; HelpURL: https://pl.mouser.com/datasheet/2/447/PYu-RC_Group_51_RoHS_L_10-1527934.pdf; RoHS: Compliant; Max Operating Temperature: 155°C; Supplier 1: Mouser; Supplier Part Number 1: 603-RC0402FR-0718K7L; Manufacturer 2: Uniroyal Elec; Manufacturer Part Number 2: 0402WGF1872TCE; Supplier 2: LCSC; Supplier Part Number 2: C11476
U14 = TPS54308DDCR: FCCM SYNCHRONOUS STEP DOWN CONVE; Manufacturer: Texas Instruments; Number of Outputs: 1; Max Output Current: 5A; Min Output Voltage: 1.2V; Min Input Voltage: 4.5V; Max Input Voltage: 28V; Max Output Voltage: 28; Output Configuration: Buck; Quiescent Current: 300u; Box: 266; Part Number: TPS54308DDCR; Manufacturer Part Number: TPS54308DDCR; Max Operating Temperature: 125; Mount: surface mount; HelpURL: http://www.ti.com/lit/ds/symlink/tps54308.pdf; Number of Pins: 6; RoHS: Compliant; Case/Package: SOT23-6; Supplier 1: Mouser; Supplier Part Number 1: 595-TPS54308DDCR; Stock: 47

## Sheet SIMO_SWITCHER.SchDoc
size A4; ApprovedBy: Mateusz Kowalik; CheckedBy: Mateusz Kowalik; Author: Mateusz Kowalik; CompanyName: InMotion Labs sp. z o.o.; DrawnBy: Mateusz Kowalik; Engineer: Mateusz Kowalik; Organization: InMotion Labs sp. z o.o.; Address1: Rydlówka 5A; Address2: 30-363 Kraków; Address4: Poland; DocumentNumber: 8; Revision: Rev 0; SheetNumber: 7; SheetTotal: 17
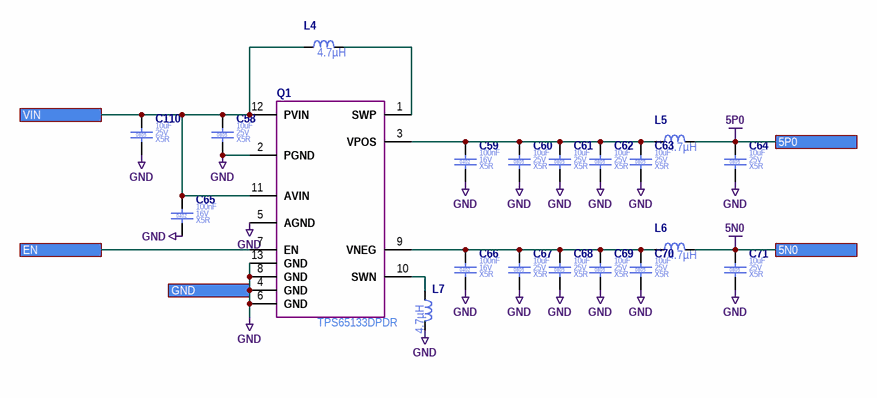
[diagram p9: SIMO_SWITCHER.SchDoc]

### Parts
C58  Case/Package: 0805  Voltage Rating (DC): 25V  Dielectric: X5R  Capacitance: 10uF  [C_0805_2012]  (hidden comment: C_10UF_25V_X5R_0805_10)
C59  Case/Package: 0402  Voltage Rating (DC): 16V  Dielectric: X5R  Capacitance: 100nF  [C_0402_1005]  (hidden comment: C_100NF_16V_X5R_0402_10)
C60  Case/Package: 0805  Voltage Rating (DC): 25V  Dielectric: X5R  Capacitance: 10uF  [C_0805_2012]  (hidden comment: C_10UF_25V_X5R_0805_10)
C61  Case/Package: 0805  Voltage Rating (DC): 25V  Dielectric: X5R  Capacitance: 10uF  [C_0805_2012]  (hidden comment: C_10UF_25V_X5R_0805_10)
C62  Case/Package: 0805  Voltage Rating (DC): 25V  Dielectric: X5R  Capacitance: 10uF  [C_0805_2012]  (hidden comment: C_10UF_25V_X5R_0805_10)
C63  Case/Package: 0805  Voltage Rating (DC): 25V  Dielectric: X5R  Capacitance: 10uF  [C_0805_2012]  (hidden comment: C_10UF_25V_X5R_0805_10)
C64  Case/Package: 0805  Voltage Rating (DC): 25V  Dielectric: X5R  Capacitance: 10uF  [C_0805_2012]  (hidden comment: C_10UF_25V_X5R_0805_10)
C65  Case/Package: 0402  Voltage Rating (DC): 16V  Dielectric: X5R  Capacitance: 100nF  [C_0402_1005]  (hidden comment: C_100NF_16V_X5R_0402_10)
C66  Case/Package: 0402  Voltage Rating (DC): 16V  Dielectric: X5R  Capacitance: 100nF  [C_0402_1005]  (hidden comment: C_100NF_16V_X5R_0402_10)
C67  Case/Package: 0805  Voltage Rating (DC): 25V  Dielectric: X5R  Capacitance: 10uF  [C_0805_2012]  (hidden comment: C_10UF_25V_X5R_0805_10)
C68  Case/Package: 0805  Voltage Rating (DC): 25V  Dielectric: X5R  Capacitance: 10uF  [C_0805_2012]  (hidden comment: C_10UF_25V_X5R_0805_10)
C69  Case/Package: 0805  Voltage Rating (DC): 25V  Dielectric: X5R  Capacitance: 10uF  [C_0805_2012]  (hidden comment: C_10UF_25V_X5R_0805_10)
C70  Case/Package: 0805  Voltage Rating (DC): 25V  Dielectric: X5R  Capacitance: 10uF  [C_0805_2012]  (hidden comment: C_10UF_25V_X5R_0805_10)
C71  Case/Package: 0805  Voltage Rating (DC): 25V  Dielectric: X5R  Capacitance: 10uF  [C_0805_2012]  (hidden comment: C_10UF_25V_X5R_0805_10)
C110  Case/Package: 0805  Voltage Rating (DC): 25V  Dielectric: X5R  Capacitance: 10uF  [C_0805_2012]  (hidden comment: C_10UF_25V_X5R_0805_10)
L4  Inductance: 4.7µH  [L_1008_2520]  (hidden comment: 1239AS-H-4R7M=P2)
L5  Inductance: 4.7µH  [L_1008_2520]  (hidden comment: 1239AS-H-4R7M=P2)
L6  Inductance: 4.7µH  [L_1008_2520]  (hidden comment: 1239AS-H-4R7M=P2)
L7  Inductance: 4.7µH  [L_1008_2520]  (hidden comment: 1239AS-H-4R7M=P2)
Q1  TPS65133DPDR  [SON45P300X80_HS-13N]

### Ports
5N0, 5P0, EN, GND, VIN

### Nets
5N0: C71.1 L6.2 ; port 5N0
5P0: C64.1 L5.2 ; port 5P0
5V0_USB: C58.1 C65.1 C110.1 L4.1 Q1.11(AVIN) Q1.12(PVIN) ; port VIN
GND: C58.2 C59.2 C60.2 C61.2 C62.2 C63.2 C64.2 C65.2 C66.2 C67.2 C68.2 C69.2 C70.2 C71.2 C110.2 L7.2 Q1.2(PGND) Q1.4(GND) Q1.5(AGND) Q1.6(GND) Q1.8(GND) Q1.13(GND) ; port GND
POWER_CTRL.SIMO_EN: Q1.7(EN) ; port EN
NetC59_1: C59.1 C60.1 C61.1 C62.1 C63.1 L5.1 Q1.3(VPOS)
NetC66_1: C66.1 C67.1 C68.1 C69.1 C70.1 L6.1 Q1.9(VNEG)
NetL4_2: L4.2 Q1.1(SWP)
NetL7_1: L7.1 Q1.10(SWN)

### Notes on the sheet
- Title
- Size:
- Date:
- A4

### Library data of the parts
C58 C60-C64 C67-C71 C110 = C_10UF_25V_X5R_0805_10: as C45 on sheet 3V3_LDO; Part Number: C_10UF_25V_X5R_0805_10; Mount: Surface Mount; Height: 1.35mm; HelpURL: https://pl.mouser.com/datasheet/2/585/MLCC-1837944.pdf; RoHS: Compliant; Max Operating Temperature: 85°C; Status: MK; Supplier 1: Mouser; Supplier Part Number 1: 187-CL21A106KAYNNNE; Supplier 2: LCSC; Supplier Part Number 2: C15850; Manufacturer 2: Samsung Electro-Mechanics; Manufacturer Part Number 2: CL21A106KAYNNNE
C59 C65 C66 = C_100NF_16V_X5R_0402_10: as C47 on sheet 3V3_LDO; Part Number: C_100NF_16V_X5R_0402_10; Mount: Surface Mount; Height: 500um; HelpURL: http://datasheet.octopart.com/EMK105BJ104KV-F-Taiyo-Yuden-datasheet-8857305.pdf; RoHS: Compliant; Max Operating Temperature: 125°C; Status: MK; Supplier 1: Mouser; Supplier Part Number 1: 963-EMK105BJ104KV-F; Manufacturer 2: Samsung Electro-Mechanics; Manufacturer Part Number 2: CL05B104KO5NNNC; Supplier 2: LCSC; Supplier Part Number 2: C1525
L4-L7 = 1239AS-H-4R7M=P2: Power Inductor; Manufacturer: Murata Electronics; Value: 4.7µH; DC Current: 1.5A; Tolerance: 20%; DC Resistance: 240m; Part Number: 1239AS-H-4R7M=P2; Manufacturer Part Number: 1239AS-H-4R7M=P2; Case/Package: DFE252012C; Mount: Surface Mount; Height: 1.2mm; HelpURL: https://pl.mouser.com/datasheet/2/281/product-1023181.pdf; Max Operating Temperature: 85°C; Status: MK; RoHS: Compliant; Supplier 1: Mouser; Supplier Part Number 1: 81-1239AS-H-4R7MP2
Q1 = TPS65133DPDR: Split-Rail Converter, ±5V, 250mA Dual Output Power Supply; Manufacturer: Texas Instruments; Number of Outputs: 2; Min Output Voltage: +/-5V; Min Input Voltage: 2.9V; Marking: SHY; Output Configuration: Positive,Negative; Quiescent Current: 0.1uA; Synchronous Rectifier: Yes; Manufacturer Part Number: TPS65133DPDR; Part Number: TPS65133DPDR; Max Output Current: 250mA; Max Input Voltage: 5V; Max Output Voltage: +/-5V; Max Operating Temperature: 85; HelpURL: https://www.ti.com/lit/ds/symlink/tps65133.pdf; Number of Pins: 12; RoHS: Compliant; Status: MK; Case/Package: WSON12; Supplier 1: Mouser; Supplier Part Number 1: 595-TPS65133DPDR

## Sheet Programmable_Delay_Line.SchDoc
size A4; ApprovedBy: Mateusz Kowalik; CheckedBy: Mateusz Kowalik; Author: Mateusz Kowalik; CompanyName: InMotion Labs sp. z o.o.; DrawnBy: Mateusz Kowalik; Engineer: Mateusz Kowalik; Organization: InMotion Labs sp. z o.o.; Address1: Rydlówka 5A; Address2: 30-363 Kraków; Address4: Poland; DocumentNumber: 10; Revision: Rev 0; SheetNumber: 9; SheetTotal: 17
Used 2 times, as channels PROGRAMMABLE_DELAY_LINE_MAIN, PROGRAMMABLE_DELAY_LINE_STEP_GEN. Parts and nets are listed once, with the designators drawn on the sheet.
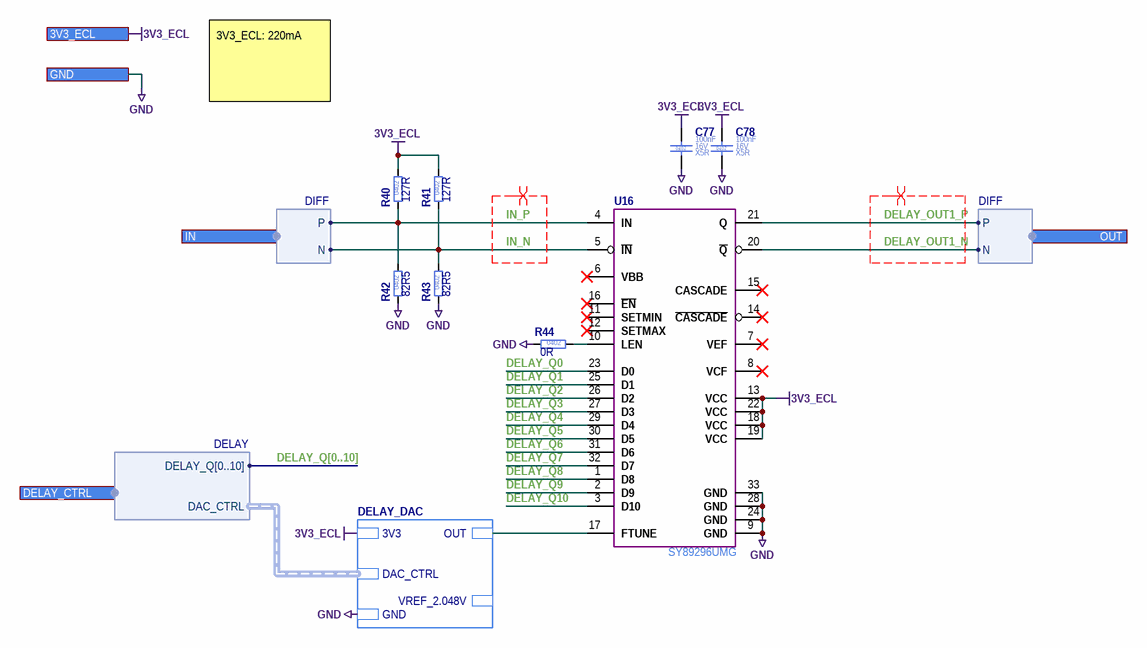
[diagram p10: Programmable_Delay_Line.SchDoc]

### Parts
C77  Case/Package: 0402  Voltage Rating (DC): 16V  Dielectric: X5R  Capacitance: 100nF  [C_0402_1005]  (hidden comment: C_100NF_16V_X5R_0402_10)
C78  Case/Package: 0402  Voltage Rating (DC): 16V  Dielectric: X5R  Capacitance: 100nF  [C_0402_1005]  (hidden comment: C_100NF_16V_X5R_0402_10)
R40  Resistance: 127R  Case/Package: 0402  [R_0402_1005]  (hidden comment: R_127R_0402_1)
R41  Resistance: 127R  Case/Package: 0402  [R_0402_1005]  (hidden comment: R_127R_0402_1)
R42  Resistance: 82R5  Case/Package: 0402  [R_0402_1005]  (hidden comment: R_82R5_0402_1)
R43  Resistance: 82R5  Case/Package: 0402  [R_0402_1005]  (hidden comment: R_82R5_0402_1)
R44  Resistance: 0R  Case/Package: 0402  [R_0402_1005]  (hidden comment: R_0R_0402_1)
U16  SY89296UMG  [QFN50P500X500X100_HS-33N]

### Sub-sheets
DELAY_DAC = DAC_12bit.SchDoc: 3V3, DAC_CTRL (harness DAC), VREF_2.048V, OUT, GND

### Ports
3V3_ECL, DELAY_CTRL (harness DELAY), GND, IN (harness DIFF), OUT (harness DIFF)

### Harnesses
DIFF: P, N
DELAY: DELAY_Q[0..10], DAC_CTRL

### Nets
3V3_ECL: C77.1 C78.1 R40.2 R41.2 U16.13(VCC) U16.18(VCC) U16.19(VCC) U16.22(VCC) ; port 3V3_ECL, sheet DELAY_DAC/3V3
GND: C77.2 C78.2 R42.1 R43.1 R44.1 U16.9(GND) U16.24(GND) U16.28(GND) U16.33(GND) ; port GND, sheet DELAY_DAC/GND
DELAY_OUT1_N: U16.20(~{Q}) ; port OUT.N
DELAY_OUT1_P: U16.21(Q) ; port OUT.P
DELAY_Q0: U16.23(D0)  [project net DELAY_Q0_9]
DELAY_Q1: U16.25(D1)  [project net DELAY_Q1_9]
DELAY_Q2: U16.26(D2)  [project net DELAY_Q2_9]
DELAY_Q3: U16.27(D3)  [project net DELAY_Q3_9]
DELAY_Q4: U16.29(D4)  [project net DELAY_Q4_9]
DELAY_Q5: U16.30(D5)  [project net DELAY_Q5_9]
DELAY_Q6: U16.31(D6)  [project net DELAY_Q6_9]
DELAY_Q7: U16.32(D7)  [project net DELAY_Q7_9]
DELAY_Q8: U16.1(D8)  [project net DELAY_Q8_9]
DELAY_Q9: U16.2(D9)  [project net DELAY_Q9_9]
DELAY_Q10: U16.3(D10)  [project net DELAY_Q10_9]
IN_N: R41.1 R43.2 U16.5(~{IN}) ; port IN.N
IN_P: R40.1 R42.2 U16.4(IN) ; port IN.P
NetR44_2: R44.2 U16.10(LEN)
NetU16_17: U16.17(FTUNE) ; sheet DELAY_DAC/OUT

Not connected (* = marked no-connect by the designer): U16 6(VBB)* 7(VEF)* 8(VCF)* 11(SETMIN)* 12(SETMAX)* 14(~{CASCADE})* 15(CASCADE)* 16(~{EN})*

### Channels
PROGRAMMABLE_DELAY_LINE_MAIN: designators end in _PROGRAMMABLE_DELAY_LINE_MAIN; ports 3V3_ECL=3V3_ECL GND=GND
PROGRAMMABLE_DELAY_LINE_STEP_GEN: designators end in _PROGRAMMABLE_DELAY_LINE_STEP_GEN; ports 3V3_ECL=3V3_ECL GND=GND

### Buses and harness runs
bus DELAY_Q[0..10]

### Layout directives
differential pair; differential pair class D100; net class D100: DELAY_OUT1_N, DELAY_OUT1_P, IN_N, IN_P

### Notes on the sheet
- 3V3_ECL: 220mA
- Title
- Size:
- Date:
- A4

### Library data of the parts
C77 C78 = C_100NF_16V_X5R_0402_10: as C47 on sheet 3V3_LDO; Part Number: C_100NF_16V_X5R_0402_10; Mount: Surface Mount; Height: 500um; HelpURL: http://datasheet.octopart.com/EMK105BJ104KV-F-Taiyo-Yuden-datasheet-8857305.pdf; RoHS: Compliant; Max Operating Temperature: 125°C; Status: MK; Supplier 1: Mouser; Supplier Part Number 1: 963-EMK105BJ104KV-F; Manufacturer 2: Samsung Electro-Mechanics; Manufacturer Part Number 2: CL05B104KO5NNNC; Supplier 2: LCSC; Supplier Part Number 2: C1525
R40 R41 = R_127R_0402_1: Thick Film Resistor; Manufacturer: Yageo; Manufacturer Part Number: RC0402FR-07127RL; Value: 127R; Tolerance: 1%; Voltage Rating (DC): 50V; Power Rating: 63mW; Stats: MK; Part Number: R_127R_0402_1; Mount: Surface Mount; Height: 350um; HelpURL: https://pl.mouser.com/datasheet/2/447/PYu_RC_Group_51_RoHS_L_10-1664068.pdf; RoHS: Compliant; Max Operating Temperature: 155°C; Supplier 1: Mouser; Supplier Part Number 1: 603-RC0402FR-07127RL; Manufacturer 2: Uniroyal Elec; Manufacturer Part Number 2: 0402WGF1270TCE; Supplier 2: LCSC; Supplier Part Number 2: C247127
R42 R43 = R_82R5_0402_1: Thick Film Resistor; Manufacturer: Yageo; Manufacturer Part Number: RC0402FR-0782R5L; Value: 82R5; Tolerance: 1%; Voltage Rating (DC): 50V; Power Rating: 63mW; Stats: MK; Part Number: R_82R5_0402_1; Mount: Surface Mount; Height: 350um; HelpURL: https://pl.mouser.com/datasheet/2/447/PYu-RC_Group_51_RoHS_L_10-1527934.pdf; RoHS: Compliant; Max Operating Temperature: 155°C; Supplier 1: Mouser; Supplier Part Number 1: 603-RC0402FR-0782R5L; Manufacturer 2: Uniroyal Elec; Manufacturer Part Number 2: 0402WGF825JTCE; Supplier 2: LCSC; Supplier Part Number 2: C52037
R44 = R_0R_0402_1: as R25 on sheet 3V3_LDO; Part Number: R_0R_0402_1; Mount: Surface Mount; Height: 350um; HelpURL: http://datasheet.octopart.com/2176049-1-TE-Connectivity---AMP-datasheet-11120217.pdf; RoHS: Compliant; Max Operating Temperature: 155°C; Supplier 1: Mouser; Supplier Part Number 1: 603-RC0402FR-070RL; Manufacturer 2: Uniroyal Elec; Manufacturer Part Number 2: 0402WGF0000TCE; Supplier 2: LCSC; Supplier Part Number 2: C17168
U16 = SY89296UMG: Delay Lines/Timing Elements 2.5V/3.3V PECL Delay Line; Manufacturer: Microchip; Max Frequency: 1.5GHz; Max Supply Current: 220mA; Max Supply Voltage: 3.6V; Min Supply Voltage: 2.375V; Part Number: SY89296UMG; Case/Package: QFN32; Mount: Surface Mount; Height: 0.9mm; HelpURL: https://datasheet.octopart.com/SY89296UTG-Microchip-datasheet-11975343.pdf; Logic Function: Delay Line; Marking: SY89296U; Max Operating Temperature: 85°C; Number of Pins: 32; RoHS: Compliant; Status: MK; Manufacturer Part Number: SY89296UMG; Supplier 1: Mouser; Supplier Part Number 1: 998-SY89296UMG